# Altium schematic sheet Sheet1.SchDoc
size A4; SheetNumber: 1; SheetTotal: 1
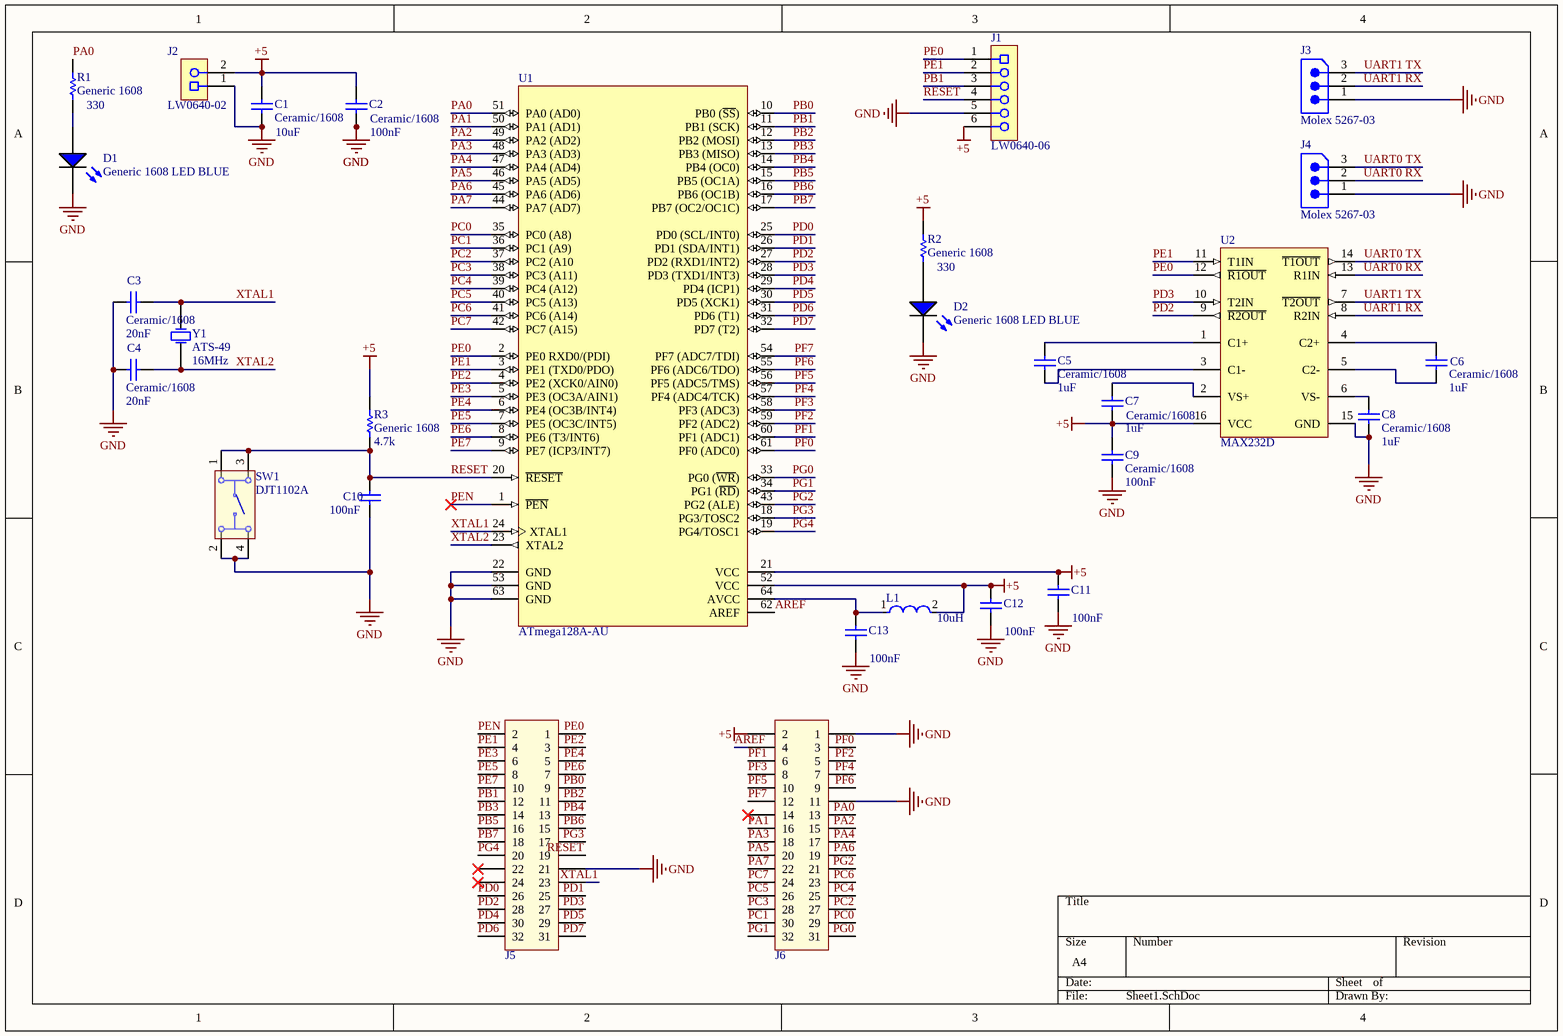
[diagram p0: Sheet1.SchDoc]

## Parts
C1  Ceramic/1608  value 10uF  [Generic 1608-Footprint-1]
C2  Ceramic/1608  value 100nF  [Generic 1608-Footprint-1]
C3  Ceramic/1608  value 20nF  [Generic 1608-Footprint-1]
C4  Ceramic/1608  value 20nF  [Generic 1608-Footprint-1]
C5  Ceramic/1608  value 1uF  [Generic 1608-Footprint-1]
C6  Ceramic/1608  value 1uF  [Generic 1608-Footprint-1]
C7  Ceramic/1608  value 1uF  [Generic 1608-Footprint-1]
C8  Ceramic/1608  value 1uF  [Generic 1608-Footprint-1]
C9  Ceramic/1608  value 100nF  [Generic 1608-Footprint-1]
C10  value 100nF  [Generic 1608-Footprint-1]  (hidden comment: Ceramic/1608)
C11  value 100nF  [Generic 1608-Footprint-1]  (hidden comment: Ceramic/1608)
C12  value 100nF  [Generic 1608-Footprint-1]  (hidden comment: Ceramic/1608)
C13  value 100nF  [Generic 1608-Footprint-1]  (hidden comment: Ceramic/1608)
D1  Generic 1608 LED BLUE  [Generic 1608 LED BLUE-Footprint-1]
D2  Generic 1608 LED BLUE  [Generic 1608 LED BLUE-Footprint-1]
J1  LW0640-06  [LW0640-06]
J2  LW0640-02  [LW0640-02]
J3  Molex 5267-03  [Molex 5267-03-Footprint]
J4  Molex 5267-03  [Molex 5267-03-Footprint]
J5  61303221121  [61303221121]  (value not drawn)
J6  61303221121  [61303221121]  (value not drawn)
L1  value 10uH  [FP-MLZ1608-MFG]  (hidden comment: MLZ1608M100WT000)
R1  Generic 1608  value 330  [Generic 1608-Footprint-1]
R2  Generic 1608  value 330  [Generic 1608-Footprint-1]
R3  Generic 1608  value 4.7k  [Generic 1608-Footprint-1]
SW1  DJT1102A  [DJT1102A-Footprint-1]
U1  ATmega128A-AU  [64A_N]
U2  MAX232D  [D0016A_M]
Y1  ATS-49  value 16MHz  [ATS-49-Footprint-1]

## Nets
+5: C1.1 C2.1 C7.1 C9.2 C11.1 C12.1 J1.6 J2.2 J6.2 L1.2 R2.2 R3.2 U1.21(VCC) U1.52(VCC) U2.16(VCC)
GND: C1.2 C2.2 C3.1 C4.1 C8.1 C9.1 C10.2 C11.2 C12.2 C13.2 D1.2(K) D2.2(K) J1.5 J2.1 J3.1 J4.1 J5.21 J6.1 J6.11 SW1.2 SW1.4 U1.22(GND) U1.53(GND) U1.63(GND) U2.15(GND)
AREF: J6.4 U1.62(AREF)
PA0: J6.13 R1.2 U1.51(PA0_(AD0))
PA1: J6.16 U1.50(PA1_(AD1))
PA2: J6.15 U1.49(PA2_(AD2))
PA3: J6.18 U1.48(PA3_(AD3))
PA4: J6.17 U1.47(PA4_(AD4))
PA5: J6.20 U1.46(PA5_(AD5))
PA6: J6.19 U1.45(PA6_(AD6))
PA7: J6.22 U1.44(PA7_(AD7))
PB0: J5.9 U1.10(PB0_(~{SS}))
PB1: J1.3 J5.12 U1.11(PB1_(SCK))
PB2: J5.11 U1.12(PB2_(MOSI))
PB3: J5.14 U1.13(PB3_(MISO))
PB4: J5.13 U1.14(PB4_(OC0))
PB5: J5.16 U1.15(PB5_(OC1A))
PB6: J5.15 U1.16(PB6_(OC1B))
PB7: J5.18 U1.17(PB7_(OC2/OC1C))
PC0: J6.29 U1.35(PC0_(A8))
PC1: J6.30 U1.36(PC1_(A9))
PC2: J6.27 U1.37(PC2_(A10)
PC3: J6.28 U1.38(PC3_(A11))
PC4: J6.25 U1.39(PC4_(A12))
PC5: J6.26 U1.40(PC5_(A13))
PC6: J6.23 U1.41(PC6_(A14))
PC7: J6.24 U1.42(PC7_(A15))
PD0: J5.26 U1.25(PD0_(SCL/INT0))
PD1: J5.25 U1.26(PD1_(SDA/INT1))
PD2: J5.28 U1.27(PD2_(RXD1/INT2)) U2.9(~{R2OUT})
PD3: J5.27 U1.28(PD3_(TXD1/INT3)) U2.10(T2IN)
PD4: J5.30 U1.29(PD4_(ICP1))
PD5: J5.29 U1.30(PD5_(XCK1))
PD6: J5.32 U1.31(PD6_(T1))
PD7: J5.31 U1.32(PD7_(T2))
PE0: J1.1 J5.1 U1.2(PE0_RXD0/(PDI)) U2.12(~{R1OUT})
PE1: J1.2 J5.4 U1.3(PE1_(TXD0/PDO)) U2.11(T1IN)
PE2: J5.3 U1.4(PE2_(XCK0/AIN0))
PE3: J5.6 U1.5(PE3_(OC3A/AIN1))
PE4: J5.5 U1.6(PE4_(OC3B/INT4))
PE5: J5.8 U1.7(PE5_(OC3C/INT5))
PE6: J5.7 U1.8(PE6_(T3/INT6))
PE7: J5.10 U1.9(PE7_(ICP3/INT7))
PEN: J5.2 U1.1(~{PEN})
PF0: J6.3 U1.61(PF0_(ADC0))
PF1: J6.6 U1.60(PF1_(ADC1))
PF2: J6.5 U1.59(PF2_(ADC2))
PF3: J6.8 U1.58(PF3_(ADC3))
PF4: J6.7 U1.57(PF4_(ADC4/TCK))
PF5: J6.10 U1.56(PF5_(ADC5/TMS))
PF6: J6.9 U1.55(PF6_(ADC6/TDO))
PF7: J6.12 U1.54(PF7_(ADC7/TDI))
PG0: J6.31 U1.33(PG0_(~{WR}))
PG1: J6.32 U1.34(PG1_(~{RD}))
PG2: J6.21 U1.43(PG2_(ALE))
PG3: J5.17 U1.18(PG3/TOSC2)
PG4: J5.20 U1.19(PG4/TOSC1)
RESET: C10.1 J1.4 J5.19 R3.1 SW1.1 SW1.3 U1.20(~{RESET})
UART0 RX: J4.2 U2.13(R1IN)
UART0 TX: J4.3 U2.14(~{T1OUT})
UART1 RX: J3.2 U2.8(R2IN)
UART1 TX: J3.3 U2.7(~{T2OUT})
XTAL1: C3.2 J5.23 U1.24(XTAL1) Y1.2(OSC2)
XTAL2: C4.2 U1.23(XTAL2) Y1.1(OSC1)
NetC5_1: C5.1 U2.3(C1-)
NetC5_2: C5.2 U2.1(C1+)
NetC6_1: C6.1 U2.5(C2-)
NetC6_2: C6.2 U2.4(C2+)
NetC7_2: C7.2 U2.2(VS+)
NetC8_2: C8.2 U2.6(VS-)
NetC13_1: C13.1 L1.1 U1.64(AVCC)
NetD1_1: D1.1(A) R1.1
NetD2_1: D2.1(A) R2.1

Not connected (* = marked no-connect by the designer): J5 22* 24*; J6 14*

## Library data of the parts
C1-C13 = CMP-002-0009-2: Generic 1608 Ceramic Capacitor; Capacitor Type: Ceramic; Case/Package: 1608; Mount: SMD; Pins: 2; RoHS: Yes
D1 D2 = CMP-008-0003-2: Generic 1608 LED <BLUE>
J1 = CMP-003-0008-4: 6-pin Molex 5045 compatible Hanlim Connector; Pin Count: 6
J2 = CMP-003-0004-4: 2-pin Molex 5045 compatible Hanlim Connector; Pin Count: 2
J3 J4 = CMP-003-0028-2: 2.50mm (.098") Pitch SPOX Wire-to-Board Header, Vertical, Shrouded, 3 Circuits, Tin (Sn) Plating; Number of Positions: 3; Insulation Resistance: 1GR; Gender: Male; Shrouded: Yes (With); Voltage Rating (AC): 250V; Current Rating: 3A; Pitch: 2.5mm; Glow Wire Compliant: Non-compliant; Contact Resistance: 20mR; Test Voltage: 1kV; Lead Free: Lead Free; Mount: Through Hole,PCB; Number of Circuits: 3; Min Operating Temperature: -40°C; Flammability Rating: UL94 V-0; Contact Material: Brass,Tin; Max Operating Temperature: 105°C; Contact Plating: Tin,Copper; Termination: Solder; Voltage Rating (DC): 250V; Contact Gender: Male; Package Quantity: 25000; REACH SVHC: Unknown; Housing Material: Nylon; Number of Rows: 1; Number of Poles: 3; Voltage Rating: 250V; Orientation: Straight; Packaging: Bulk; Number of Contacts: 3; Working Voltage: 250V; Radiation Hardening: No
J5 J6 = CMP-005-0116-1: Pin Header WR-PHD, pitch 2.54 mm, THT, Vertical, dual row, 32 pin; Contact Resistance: 20 mOhm; Insulation Resistance: >1000 MOhm; Pin Number: 32; Pitch: 2.54 mm; Rated Current: 3 A; Working Voltage: 250 VAC; Component Name: 61303221121; ComponentLink1Description: Manufacturer; ComponentLink1URL: http://www.we-online.de; ComponentLink2Description: Datasheet; ComponentLink2URL: http://katalog.we-online.de/em/datasheet/6130xx21121.pdf; Designator: 61303221121; Mounting Technology: THT; Operating Temperature: -40 to 105 degC; Orientation: Vertical; Part Number: 61303221121; Pin Count: 32; Published Date: Jan. 2018; Publisher: Wurth Elektronik; Row Number: Dual
L1 = CMP-08253-000012-1: FIXED IND 10UH 250MA 1.05 OHM; Manufacturer: TDK; Series Resistance: 1.05Ω; Tolerance: 20%; Shielding: true; Core Material: Ferrite; Saturation Current: 90mA; Test Frequency: 2MHz; Digikey Description: FIXED IND 10UH 250MA 1.05 OHM; Inductance: 10uH; Composition: Multilayer; Device Class L3: Fixed Inductors; Temperature: -55°C to +125°C; RoHS: TRUE; Temperature Range High: +125°C; Automotive: No; Device Class L2: Inductors; Temperature Range Low: -55°C; Rms Current: 250mA; Manufacturer Part Number: MLZ1608M100WT000; Category: Ind; Height: 0.95mm; Package: MLZ1608; Device Class L1: Passive Components; Lead Free: Yes; ComponentLink2Description: Datasheet; Octopart: https://octopart.com/mlz1608m100wt000-tdk-22244539; Ipc Land Pattern Name: CAPC16080X80; ComponentLink2URL: https://product.tdk.com/info/en/catalog/datasheets/inductor_commercial_decoupling_mlz1608_en.pdf
R1-R3 = CMP-001-0018-1: Generic 1608 Resistor; Case/Package: Bulk; Mount: SMD; Pins: 2; RoHS: Yes
SW1 = CMP-ROOT-00011-1: 6.0mm 6.0mm tact switch; Case/Package: 6x6mm; Mount: Thruhole; Pins: 4; RoHS: Yes
U1 = CMP-0095-00232-2: 8-bit AVR Microcontroller, 2.7-5.5V, 16MHz, 128KB Flash, 4KB EEPROM, 4KB SRAM, 64-pin TQFP, Industrial Grade (-40°C to 85°C); ComponentLink1Description: Manufacturer URL; ComponentLink2URL: http://www.atmel.com/dyn/resources/prod_documents/doc8151.pdf; ComponentLink2Description: ATmega128A Datasheet; PackageReference: 64A; RevisionNote: DatasheetVersion & PackageVersion updated. URLs added.; PackageDescription: 64-Pin Plastic Thin Profile Quad Flat Pack, 14 x 14 x 1.0 mm Body, 0.8 mm Pitch (TQFP); DatasheetVersion: revH, Feb-2011; ComponentLink1URL: http://www.atmel.com/; Code_JEDEC: MS-026-AEB; ComponentLink3Description: ATmega128A Summary; PackageVersion: revC, Oct-2010; ComponentLink3URL: http://www.atmel.com/dyn/resources/prod_documents/8151S.pdf
U2 = CMP-0299-00137-2: Dual EIA-232 Driver / Receiver, 0 to 70 degC, 16-Pin SOIC (D), Green (RoHS & no Sb/Br); Single Supply: TRUE; ICC(Max)(mA): 10; Supply Voltage(s)(V): 5; Drivers Per Package: 2; SubFamily: RS-232; ESD HBM(kV): +/-2; PackageReference: D0016A; ComponentLink3Description: Package Specification; ComponentLink1URL: www.ti.com; ComponentLink2Description: Datasheet; DatasheetVersion: SLLS047L; ComponentLink3URL: http://www.ti.com/litv/pdf/mpds178g; ComponentLink2URL: http://www.ti.com/general/docs/lit/getliterature.tsp?genericPartNumber=MAX232&fileType=pdf; PackageVersion: revM, Jun-2011; Receivers Per Package: 2; RS-232: TRUE; PackageDescription: 16-Pin Plastic Small Outline Integrated Circuit, 9.9 x 3.9 mm, Pitch 1.27 mm Pitch; ComponentLink1Description: Manufacturer URL
Y1 = CMP-015-0000-2: Crystal ATS-49U; Frequency Stability: 50ppm; Frequency Tolerance: 30ppm; Load Capacitance: 18pF; Series Resistance: 200R; Mount: Through Hole; Number of Pins: 2; RoHS: Yes; Max Operating Temperature: 70°C; Depth: 4.65mm; Case/Package: ATS-49; Length: 11.05mm; Min Operating Temperature: -20°C; ESR (Equivalent Series Resistance): 200R